# Altium project Motor_Controller_PS.PrjPcb
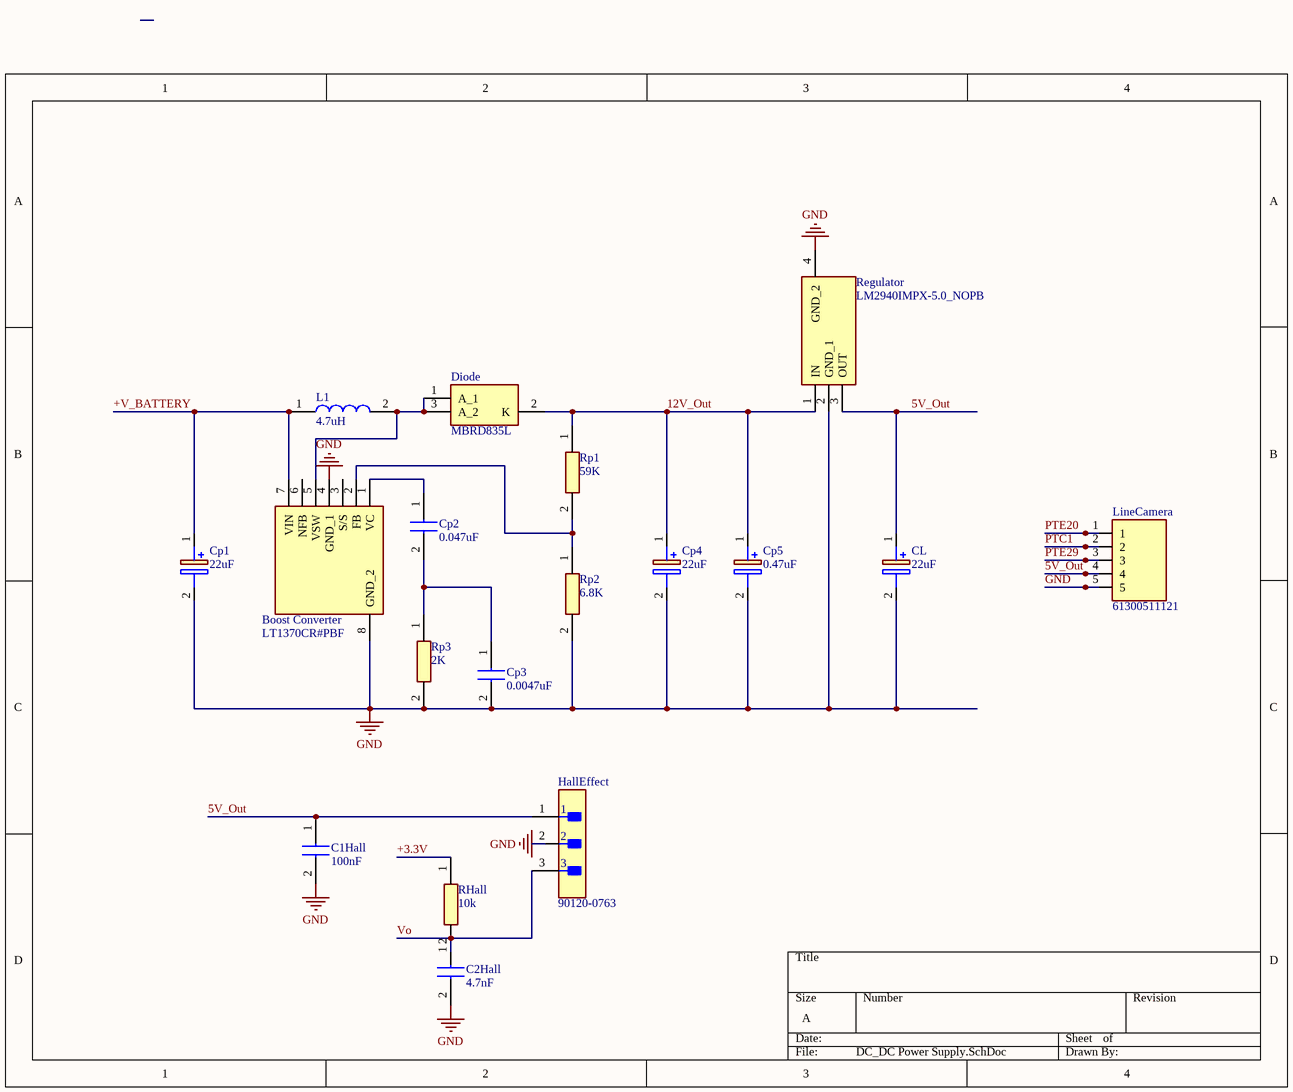
[diagram p0: DC_DC Power Supply.SchDoc]
3 sheets, 40 parts. Net scope: global (net labels, ports and power ports of the same name join across sheets).
Board files: FRDM-Shield_Template.PcbDoc, FDRM_Group6.PcbDoc
Sheets:
  DC_DC Power Supply.SchDoc
  Motor_Controller.SchDoc
  Connectors.SchDoc

## Sheet DC_DC Power Supply.SchDoc
size A; SheetNumber: 1; SheetTotal: 3

### Parts
Boost_Converter  LT1370CR#PBF  [LT1370CRPBF]
C1Hall  100nF  [CAPC5750X450N]
C2Hall  4.7nF  [C1812]
CL  22uF  [CAPAE430X550N]
Cp1  22uF  [CAPAE430X550N]
Cp2  0.047uF  [CAPC0603X33N]
Cp3  0.0047uF  [CAPC0603X33N]
Cp4  22uF  [CAPAE430X550N]
Cp5  0.47uF  [CAPAE430X550N]
Diode  MBRD835L  [MBRD835L]
HallEffect  90120-0763  [FP-90120-0763-MFG]
L1  4.7uH  [ETQ-P4M_KFM]
LineCamera  61300511121  [HDRV5W64P0X254_1X5_1270X254X854P]
Regulator  LM2940IMPX-5.0_NOPB  [SOT230P700X180-4N]
RHall  10k  [RESC1005X40N]
Rp1  59K  [ERJ2RKD1004X]
Rp2  6.8K  [RESC1608X55N]
Rp3  2K  [ERJ2RKD1004X]

### Nets
+3.3V: RHall.1
+V_BATTERY: Boost_Converter.7(VIN) Cp1.1(+) L1.1
GND: Boost_Converter.4(GND_1) Boost_Converter.8(GND_2) C1Hall.2 C2Hall.2 CL.2(-) Cp1.2(-) Cp3.2 Cp4.2(-) Cp5.2(-) HallEffect.2 LineCamera.5 Regulator.2(GND_1) Regulator.4(GND_2) Rp2.2 Rp3.2
5V_Out: C1Hall.1 CL.1(+) HallEffect.1 LineCamera.4 Regulator.3(OUT)
12V_Out: Cp4.1(+) Cp5.1(+) Diode.2(K) Regulator.1(IN) Rp1.1
PTC1: LineCamera.2
PTE20: LineCamera.1
PTE29: LineCamera.3
Vo: C2Hall.1 HallEffect.3 RHall.2
NetBoost_Converter_1: Boost_Converter.1(VC) Cp2.1
NetBoost_Converter_2: Boost_Converter.2(FB) Rp1.2 Rp2.1
NetBoost_Converter_5: Boost_Converter.5(VSW) Diode.1(A_1) Diode.3(A_2) L1.2
NetCp2_2: Cp2.2 Cp3.1 Rp3.1

Not connected (* = marked no-connect by the designer): Boost_Converter 3(S/S) 6(NFB)

### Library data of the parts
Boost_Converter = LT1370CR#PBF: 12V Boost Converter; Manufacturer_Name: Analog Devices; Datasheet Link: https://www.analog.com/media/en/technical-documentation/data-sheets/1370fs.pdf; Height: 4.877mm; Manufacturer_Part_Number: LT1370CR#PBF; Mouser Part Number: 584-LT1370CR#PBF; Mouser Price/Stock: https://www.mouser.co.uk/ProductDetail/Analog-Devices/LT1370CRPBF?qs=ytflclh7QUVSQHKAEhLuUA%3D%3D; Arrow Part Number: LT1370CR#PBF; Arrow Price/Stock: https://www.arrow.com/en/products/lt1370crpbf/analog-devices?utm_currency=USD&region=nac
C1Hall = 2220Y2K00104KXRWS3: Capacitor; Manufacturer_Name: Knowles; Datasheet Link: https://www.knowlescapacitors.com/getattachment/e7984308-bd6c-4e1d-824e-8ae6037a2b25/StackiCap; Height: 4.5mm; Manufacturer_Part_Number: 2220Y2K00104KXRWS3; Mouser Part Number: 843-2220Y2K104KXRWS2; Mouser Price/Stock: https://www.mouser.co.uk/ProductDetail/Knowles-Syfer/2220Y2K00104KXRWS3?qs=7MVldsJ5UaxGI75VDyrs7w%3D%3D
C2Hall = C1812C472KGRACAUTO: Capacitor; Manufacturer_Name: KEMET; Datasheet Link: https://content.kemet.com/datasheets/KEM_C1076_X7R_HV_AUTO_SMD.pdf; Height: 1.55mm; Manufacturer_Part_Number: C1812C472KGRACAUTO; Mouser Part Number: 80-C1812C472KGRAUTO; Mouser Price/Stock: https://www.mouser.co.uk/ProductDetail/KEMET/C1812C472KGRACAUTO?qs=f9yNj16SXrLK%252BHmDDKifeA%3D%3D; Arrow Part Number: C1812C472KGRACAUTO; Arrow Price/Stock: https://www.arrow.com/en/products/c1812c472kgracauto/kemet-corporation
CL Cp1 Cp4 = UWP1HR22MCL1GB: Capacitor Polarised; Manufacturer_Name: Nichicon; Datasheet Link: https://www.nichicon.co.jp/english/series_items/catalog_pdf/e-uwp.pdf; Height: 5.5mm; Manufacturer_Part_Number: UWP1HR22MCL1GB; Mouser Part Number: 647-UWP1HR22MCL; Mouser Price/Stock: https://www.mouser.co.uk/ProductDetail/Nichicon/UWP1HR22MCL1GB?qs=3GbUB62Nf7dRFOPfOwO6sg%3D%3D
  Cp1: Supplier 1: Digikey; Supplier Part Number 1: 493-9831-1-ND
Cp2 = GRM033R61C473KE84D: Capacitor; Manufacturer_Name: Murata Electronics; Datasheet Link: https://search.murata.co.jp/Ceramy/image/img/A01X/G101/ENG/GRM033R61C473KE84-01A.pdf; Height: 0.33mm; Manufacturer_Part_Number: GRM033R61C473KE84D; Mouser Part Number: 81-GRM033R61C473KE4D; Mouser Price/Stock: https://www.mouser.co.uk/ProductDetail/Murata-Electronics/GRM033R61C473KE84D?qs=vCoBJ5OiJk4E%252B%2Fgs75qrtQ%3D%3D; Arrow Part Number: GRM033R61C473KE84D; Arrow Price/Stock: https://www.arrow.com/en/products/grm033r61c473ke84d/murata-manufacturing
Cp3 = GRM033R71A472KA01D: Capacitor; Manufacturer_Name: Murata Electronics; Datasheet Link: https://search.murata.co.jp/Ceramy/image/img/A01X/G101/ENG/GRM033R71A472KA01-01A.pdf; Height: 0.33mm; Manufacturer_Part_Number: GRM033R71A472KA01D; Mouser Part Number: 81-GRM033R71A472KA1D; Mouser Price/Stock: https://www.mouser.co.uk/ProductDetail/Murata-Electronics/GRM033R71A472KA01D?qs=7RtWncwVCuzI4WvsbOl%2FQA%3D%3D; Arrow Part Number: GRM033R71A472KA01D; Arrow Price/Stock: https://www.arrow.com/en/products/grm033r71a472ka01d/murata-manufacturing
Cp5 = 865230640004: Capacitor Polarised; Manufacturer_Name: Wurth Elektronik; Datasheet Link: https://componentsearchengine.com/Datasheets/1/865230640004.pdf; Height: 5.5mm; Manufacturer_Part_Number: 865230640004; Mouser Part Number: 710-865230640004; Mouser Price/Stock: https://www.mouser.co.uk/ProductDetail/Wurth-Elektronik/865230640004?qs=0KOYDY2FL2%2FYTqRiFtrQpw%3D%3D
Diode = MBRD835L: Diode; Manufacturer_Name: onsemi; Datasheet Link: https://www.onsemi.com/pdf/datasheet/mbrd835l-d.pdf; Height: 2.38mm; Manufacturer_Part_Number: MBRD835L; Mouser Part Number: 863-MBRD835L; Mouser Price/Stock: https://www.mouser.co.uk/ProductDetail/onsemi/MBRD835L?qs=3JMERSakebplE9MTkRawVw%3D%3D
HallEffect = CMP-04776-000084-1: CONN HEADER VERT 3POS 2.54MM; Manufacturer: Molex; Voltage Rating: 350V; Number Of Contacts: 3; Conn Orientation: Vertical; Current Rating: 3A; Conn Gender: Male; Package: 90120-0763; ComponentLink2Description: Datasheet; Height: 5.8mm; Manufacturer Part Number: 90120-0763; Temperature Range High: +125°C; RoHS: TRUE; ComponentLink2URL: https://www.molex.com/webdocs/datasheets/pdf/en-us/0901200763_PCB_HEADERS.pdf; Device Class L2: Headers and Wire Housings; Temperature: -55°C to +125°C; Device Class L1: Connectors; Pitch: 2.54mm; Footprint Url: https://www.molex.com/pdm_docs/sd/901200763_sd.pdf; Device Class L3: unset; Temperature Range Low: -55°C; Number Of Rows: 1; Category: Conn; Lead Free: Yes; Mouser Description: Board-To-Board Connector, C-Grid III 90120 Series, Through Hole, Header, 3, 2.54 mm; Octopart: https://octopart.com/90120-0763-molex-655433; Contact Material: Gold,Nickel; Automotive: No; Digikey Description: CONN HEADER VERT 3POS 2.54MM
L1 = ETQ-P4M4R7KFM: Inductor; Manufacturer_Name: Panasonic; Datasheet Link: http://industrial.panasonic.com/cdbs/www-data/pdf/AGL0000/AGL0000C73.pdf; Height: 4.8mm; Manufacturer_Part_Number: ETQ-P4M4R7KFM; Mouser Part Number: 667-ETQ-P4M4R7KFM; Mouser Price/Stock: https://www.mouser.co.uk/ProductDetail/Panasonic/ETQ-P4M4R7KFM?qs=PqoDHHvF649m773nMECVZA%3D%3D
LineCamera = 61300511121: Connector; Manufacturer_Name: Wurth Elektronik; Datasheet Link: http://katalog.we-online.de/em/datasheet/6130xx11121.pdf; Height: 8.54mm; Manufacturer_Part_Number: 61300511121; Mouser Part Number: 710-61300511121; Mouser Price/Stock: https://www.mouser.co.uk/ProductDetail/Wurth-Elektronik/61300511121?qs=PhR8RmCirEZCsCRHq%252BvfRQ%3D%3D
Regulator = LM2940IMPX-5.0_NOPB: Integrated Circuit; Manufacturer_Name: Texas Instruments; Manufacturer_Part_Number: LM2940IMPX-5.0/NOPB; Datasheet Link: http://www.ti.com/lit/gpn/lm2940-n; Height: 1.8mm; Mouser Part Number: 926-LM2940IMPX50NOPB; Mouser Price/Stock: https://www.mouser.co.uk/ProductDetail/Texas-Instruments/LM2940IMPX-5.0-NOPB?qs=X1J7HmVL2ZELzMHXu8bpyQ%3D%3D; Arrow Part Number: LM2940IMPX-5.0/NOPB; Arrow Price/Stock: https://www.arrow.com/en/products/lm2940impx-5.0nopb/texas-instruments?region=nac
RHall = RC0402JR-0710KL: Resistor; Manufacturer_Name: KEMET; Datasheet Link: http://www.yageo.com/documents/recent/PYu-RC0402_51_RoHS_L_6_r.pdf; Height: 0.4mm; Manufacturer_Part_Number: RC0402JR-0710KL; Mouser Part Number: 603-RC0402JR-0710KL; Mouser Price/Stock: https://www.mouser.co.uk/ProductDetail/YAGEO/RC0402JR-0710KL?qs=V1yeUXFNrkk4BhFptVo0Rw%3D%3D
Rp1 = ERJ-2RKF5902X: Resistor; Manufacturer_Name: Panasonic; Datasheet Link: https://industrial.panasonic.com/cdbs/www-data/pdf/RDA0000/AOA0000C86.pdf; Height: 0.4mm; Manufacturer_Part_Number: ERJ-2RKF5902X; Mouser Part Number: 667-ERJ-2RKF5902X; Mouser Price/Stock: https://www.mouser.co.uk/ProductDetail/Panasonic/ERJ-2RKF5902X?qs=YMBIwoNQYdVdwi4zXGse%252Bw%3D%3D; Arrow Part Number: ERJ-2RKF5902X; Arrow Price/Stock: https://www.arrow.com/en/products/erj-2rkf5902x/panasonic?region=nac
Rp2 = RC0603FR-106K8L: Resistor; Manufacturer_Name: KEMET; Datasheet Link: http://www.yageo.com/documents/recent/PYu-RC0603_51_RoHS_L_v5.pdf; Height: 0.55mm; Manufacturer_Part_Number: RC0603FR-106K8L; Mouser Part Number: 603-RC0603FR-106K8L; Mouser Price/Stock: https://www.mouser.co.uk/ProductDetail/YAGEO/RC0603FR-106K8L?qs=Iqe6t0HYRD4RKBucIg6YEg%3D%3D
Rp3 = ERJ-2RKF2001X: Resistor; Manufacturer_Name: Panasonic; Datasheet Link: https://industrial.panasonic.com/cdbs/www-data/pdf/RDA0000/AOA0000C86.pdf; Height: 0.4mm; Manufacturer_Part_Number: ERJ-2RKF2001X; Mouser Part Number: 667-ERJ-2RKF2001X; Mouser Price/Stock: https://www.mouser.co.uk/ProductDetail/Panasonic/ERJ-2RKF2001X?qs=H7k1u0Mp9JSbtBe1nkwQGA%3D%3D; Arrow Part Number: ERJ-2RKF2001X; Arrow Price/Stock: https://www.arrow.com/en/products/erj-2rkf2001x/panasonic?region=europe

## Sheet Motor_Controller.SchDoc
size A; SheetNumber: 2; SheetTotal: 3
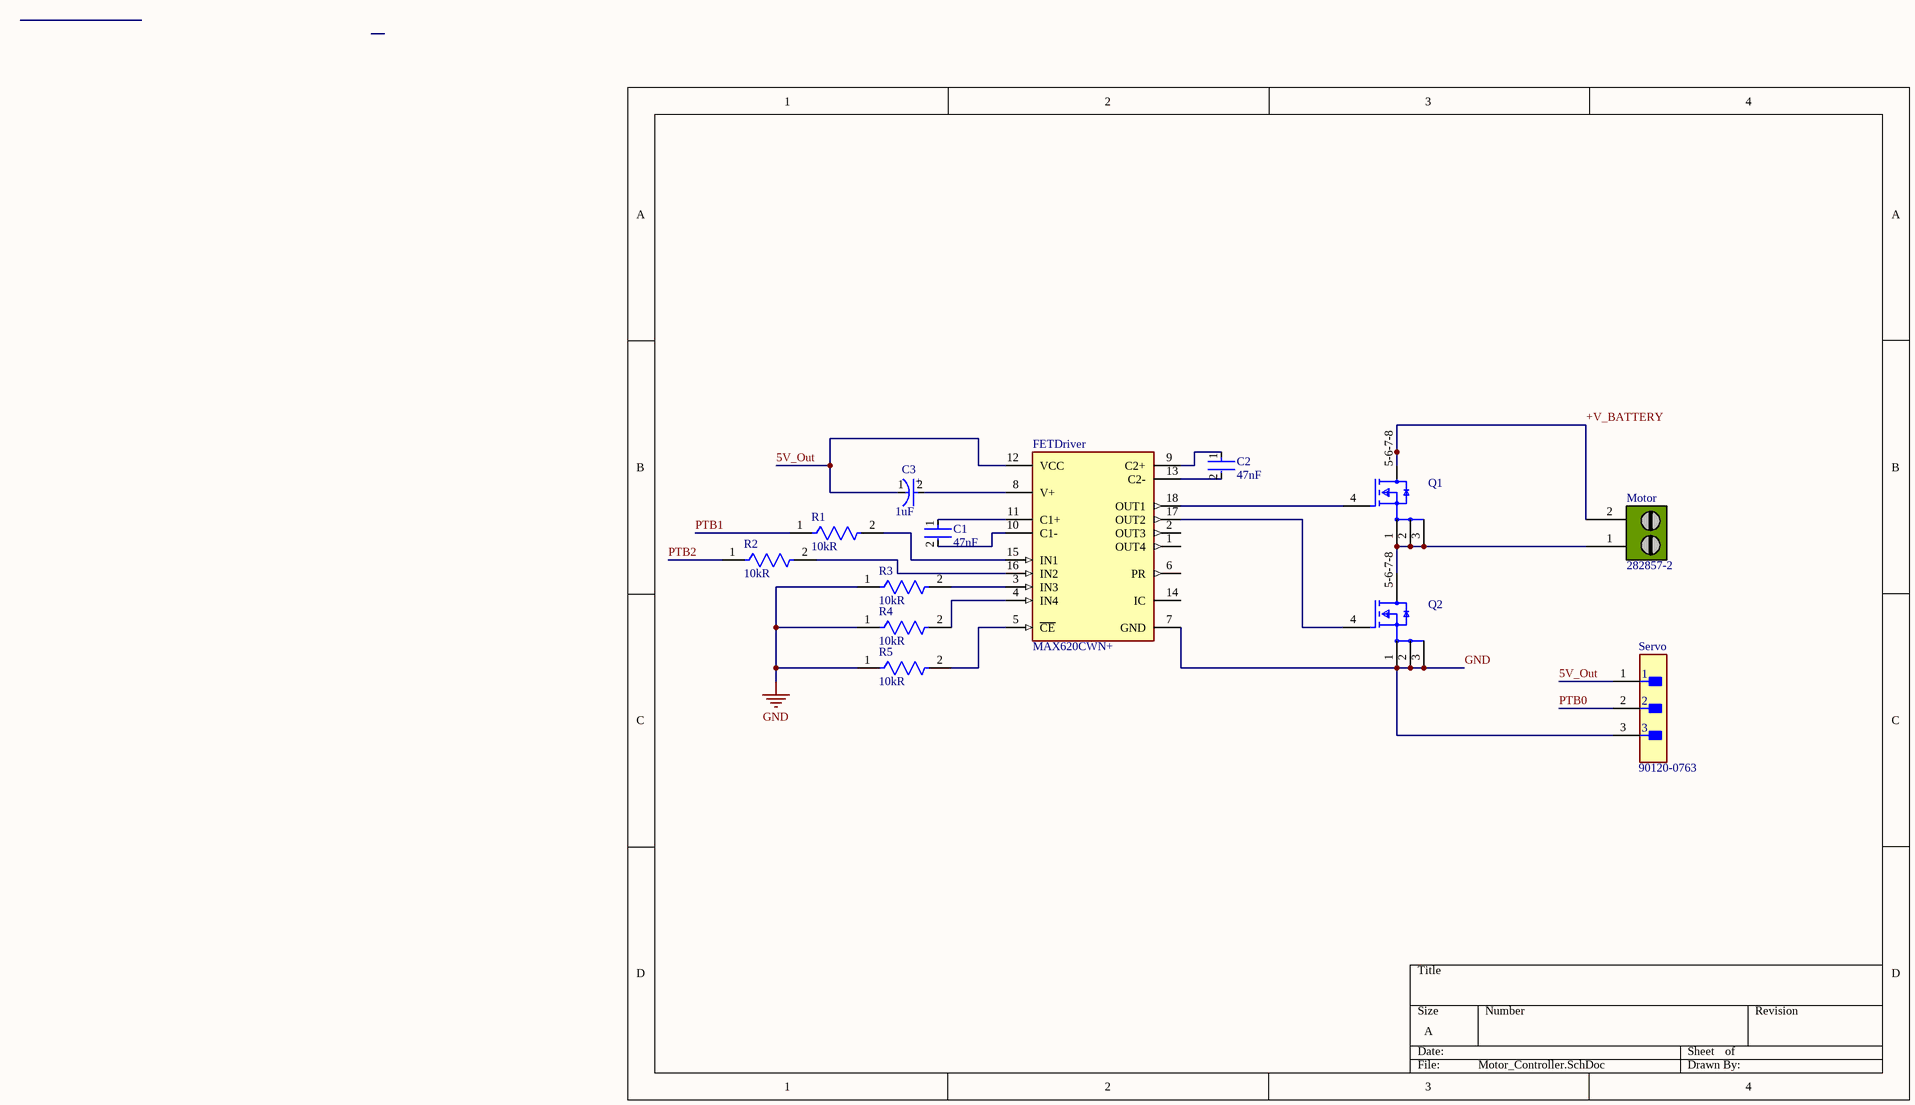
[diagram p1: Motor_Controller.SchDoc]

### Parts
C1  Capacitance: 47nF  [FP-0805-L_2_01_0_2-W_1_25-IPC_B]  (hidden comment: 08055C473JAT2A)
C2  Capacitance: 47nF  [FP-0805-L_2_01_0_2-W_1_25-IPC_B]  (hidden comment: 08055C473JAT2A)
C3  Capacitance: 1uF  [FP-T491A105K025AT-MFG]  (hidden comment: T491A105K025AT)
FETDriver  MAX620CWN+  [FP-W18-1-MFG]
Motor  282857-2  [282857-2]
Q1  CSD17306Q5A  [FP-DQJ0008A-MFG]  (value not drawn)
Q2  CSD17306Q5A  [FP-DQJ0008A-MFG]  (value not drawn)
R1  Resistance: 10kR  [FP-CR0805-IPC_B]  (hidden comment: CR0805-JW-103ELF)
R2  Resistance: 10kR  [FP-CR0805-IPC_B]  (hidden comment: CR0805-JW-103ELF)
R3  Resistance: 10kR  [FP-CR0805-IPC_B]  (hidden comment: CR0805-JW-103ELF)
R4  Resistance: 10kR  [FP-CR0805-IPC_B]  (hidden comment: CR0805-JW-103ELF)
R5  Resistance: 10kR  [FP-CR0805-IPC_B]  (hidden comment: CR0805-JW-103ELF)
Servo  90120-0763  [FP-90120-0763-MFG]

### Nets
+V_BATTERY: Motor.2 Q1.5-6-7-8(D)
GND: FETDriver.7(GND) Q2.1(S) Q2.2(S) Q2.3(S) R3.1 R4.1 R5.1 Servo.3
5V_Out: C3.1(C) FETDriver.12(VCC) Servo.1
PTB0: Servo.2
PTB1: R1.1
PTB2: R2.1
NetC1_1: C1.1 FETDriver.11(C1+)
NetC1_2: C1.2 FETDriver.10(C1-)
NetC2_1: C2.1 FETDriver.9(C2+)
NetC2_2: C2.2 FETDriver.13(C2-)
NetC3_2: C3.2(A) FETDriver.8(V+)
NetFETDriver_3: FETDriver.3(IN3) R3.2
NetFETDriver_4: FETDriver.4(IN4) R4.2
NetFETDriver_5: FETDriver.5(~{CE}) R5.2
NetFETDriver_15: FETDriver.15(IN1) R1.2
NetFETDriver_16: FETDriver.16(IN2) R2.2
NetFETDriver_17: FETDriver.17(OUT2) Q2.4(G)
NetFETDriver_18: FETDriver.18(OUT1) Q1.4(G)
NetMotor_1: Motor.1 Q1.1(S) Q1.2(S) Q1.3(S) Q2.5-6-7-8(D)

Not connected (* = marked no-connect by the designer): FETDriver 1(OUT4) 2(OUT3) 6(PR) 14(IC)

### Notes on the sheet
- (in symbol CMP-03017-000047-1) +

### Library data of the parts
C1 C2 = CMP-2007-04425-2: General Purpose Ceramic Capacitor, 0805, 47nF, 5%, X7R, 0.15, 50V; Dissipation Factor: 2.5%; Tolerance: 10%; Voltage: 50V; Voltage Rating (DC): 50V; Case Code (Imperial): 0805; Termination: SMD/SMT; Lead Free: Lead Free; Construction: Flat; Case Code (Metric): 2012; Series: -; Height: 0.94mm; Length: 2.01mm; Dielectric: X7R; Min Operating Temperature: -55°C; Voltage Rating: 50V; Max Operating Temperature: 125°C; Width: 0.049inch; Dielectric Material: Ceramic; Thickness: 0.037inch; Mount: Surface Mount; Radiation Hardening: No; REACH SVHC: No SVHC; Number of Pins: 2; Case/Package: 0805; Packaging: Tape and Reel; RoHS Compliant: Yes; Contact Plating: Tin; Depth: 1.25mm; Package Quantity: 1
C3 = CMP-03017-000047-1: CAP TANT 1UF 10% 25V 1206; Polarity: Polar; Leakage Current: 500nA; ESR (Equivalent Series Resistance): 8R; Tolerance: 20%; Dielectric Material: Tantalum; Life (Hours): 2000Hour; Dissipation Factor: 4%; Case/Package: 1206; RoHS Compliant: Yes; Voltage Rating: 25V; Voltage Rating (DC): 25V; Max Operating Temperature: 125°C; REACH SVHC: No SVHC; Lead Pitch: 1.2mm; Height - Seated (Max): 0.071inch; Packaging: Tape and Reel; Lead Free: Lead Free; Radiation Hardening: No; Width: 1.6mm; Depth: 1.6mm; Number of Pins: 2; Termination: SMD/SMT; Case Code (Metric): 3216; Features: General Purpose; Voltage: 25V; Min Operating Temperature: -55°C; Package Quantity: 1; Mount: Surface Mount; Length: 3.2mm; Height: 1.6mm; Case Code (Imperial): 1206
FETDriver = CMP-05716-000008-1: IC GATE DRVR HIGH-SIDE 18SOIC; Nominal Supply Current: 500uA; Max Power Dissipation: 762mW; Fall Time: 2500ns; Max Output Current: 25mA; Rise Time: 1700ns; Min Supply Voltage: 4.5V; Max Supply Voltage: 16.5V; Number of Outputs: 4; Max Operating Temperature: 70°C; Packaging: Rail/Tube; Mount: Surface Mount; Lead Free: Lead Free; Min Operating Temperature: 0°C; Package Quantity: 40; Radiation Hardening: No; Number of Pins: 18; Max Supply Current: 500uA; Case/Package: SOIC; Supply Current: 500uA; RoHS Compliant: Yes; Number of Drivers: 4; Series: -
Motor = 282857-2: TERM BLOCK 2POS SIDE ENT 5.08MM; Manufacturer: TE Connectivity; Number of Levels: 1; Positions Per Level: 2; Pitch: 0.200" (5.08mm); Mating Orientation: Horizontal with Board; Current: 24A; Voltage: 300V; Wire Gauge: 12-30 AWG; Wire Termination: Screw - Rising Cage Clamp; Clamp Material - Plating: Brass - Nickel Plated; Torque - Screw: 0.79 Nm (7.0 Lb-In); Screw Thread: M3; Supplier 1: Digi-Key; Supplier Part Number 1: A98359-ND; Manufacturer Part Number: 282857-2; RoHS: RoHS Compliant; Category: Connectors, Interconnects; Stock 1: 1811; Pricing 1: 1=1.19, 10=1.046, 25=0.984, 50=0.9432, 100=0.9021, 250=0.82012, 500=0.7381, 1000=0.65608, 2500=0.59457 (USD); Mounting Type: Through Hole; Features: Interlocking (Side); Color: Green; Packaging: Bulk; Operating Temperature: -; Housing Material: Polyamide (PA66), Nylon 6/6; Contact Material - Plating: Brass - Tin Plated; Screw Material - Plating: Brass - Nickel Plated; ComponentLink1URL: http://documents.tycoelectronics.com/commerce/DocumentDelivery/DDEController?Action=srchrtrv&DocNm=282857&DocType=CD&DocLang=EN; ComponentLink1Description: http://documents.tycoelectronics.com/commerce/DocumentDelivery/DDEController?Action=srchrtrv&DocNm=282857&DocType=CD&DocLang=EN; Value: 282857-2
Q1 Q2 = CMP-04962-000068-1: MOSFET N-CH 30V 24A/100A 8VSON; Element Configuration: Single; Number of Elements: 1; Turn-Off Delay Time: 18.4ns; Nominal Vgs: 1.1V; Drain to Source Resistance: 3.3mR; Rds On Max: 3.7mR; Rise Time: 13.1ns; Fall Time: 6.4ns; Turn-On Delay Time: 7.8ns; Continuous Drain Current (ID): 100A; Power Dissipation: 3.2W; Input Capacitance: 2.17nF; Gate to Source Voltage (Vgs): 10V; Polarity: N-CHANNEL; Drain to Source Breakdown Voltage: 30V; Mount: Surface Mount; Radiation Hardening: No; RoHS Compliant: Yes; Threshold Voltage: 1.1V; Contact Plating: Tin; Package Quantity: 1; Packaging: Tape and Reel; Lead Free: Contains Lead; Width: 5mm; Case/Package: SON; Max Operating Temperature: 150°C; Length: 5.8mm; Series: NexFET™; Drain to Source Voltage (Vdss): 30V; Number of Pins: 8; Min Operating Temperature: -55°C; Max Power Dissipation: 3.2W; REACH SVHC: No SVHC; Height: 1.1mm
R1-R5 = CMP-07231-003873-1: Thick Film Chip Resistors 0805 10kΩ 0.125W 5% 200ppm/°C; Power Rating: 125mW; Voltage Rating (DC): 100V; Voltage Rating: 150V; Width: 1.25mm; Composition: Thick Film; Packaging: Tape and Reel; Number of Terminations: 2; Min Operating Temperature: -55°C; Height: 0.5mm; Temperature Coefficient: 200ppm/°C; Features: Moisture Resistant; Termination: SMD/SMT; Case Code (Imperial): 0805; Package Quantity: 1; Radiation Hardening: No; Military Standard: Not; Thickness: 508um; Depth: 1.25mm; Tolerance: 5%; Contact Plating: Tin; Number of Pins: 2; Length: 2mm; Max Power Dissipation: 125mW; Mount: Surface Mount; Case Code (Metric): 2012; Case/Package: 0805; REACH SVHC: No SVHC; Max Operating Temperature: 155°C
Servo = CMP-04776-000084-1: as HallEffect on sheet DC_DC Power Supply; Package: 90120-0763; ComponentLink2Description: Datasheet; Height: 5.8mm; Manufacturer Part Number: 90120-0763; Temperature Range High: +125°C; RoHS: TRUE; ComponentLink2URL: https://www.molex.com/webdocs/datasheets/pdf/en-us/0901200763_PCB_HEADERS.pdf; Device Class L2: Headers and Wire Housings; Temperature: -55°C to +125°C; Device Class L1: Connectors; Pitch: 2.54mm; Footprint Url: https://www.molex.com/pdm_docs/sd/901200763_sd.pdf; Device Class L3: unset; Temperature Range Low: -55°C; Number Of Rows: 1; Category: Conn; Lead Free: Yes; Mouser Description: Board-To-Board Connector, C-Grid III 90120 Series, Through Hole, Header, 3, 2.54 mm; Octopart: https://octopart.com/90120-0763-molex-655433; Contact Material: Gold,Nickel; Automotive: No; Digikey Description: CONN HEADER VERT 3POS 2.54MM

## Sheet Connectors.SchDoc: TRW-TFC
size D; SheetNumber: 3; SheetTotal: 3
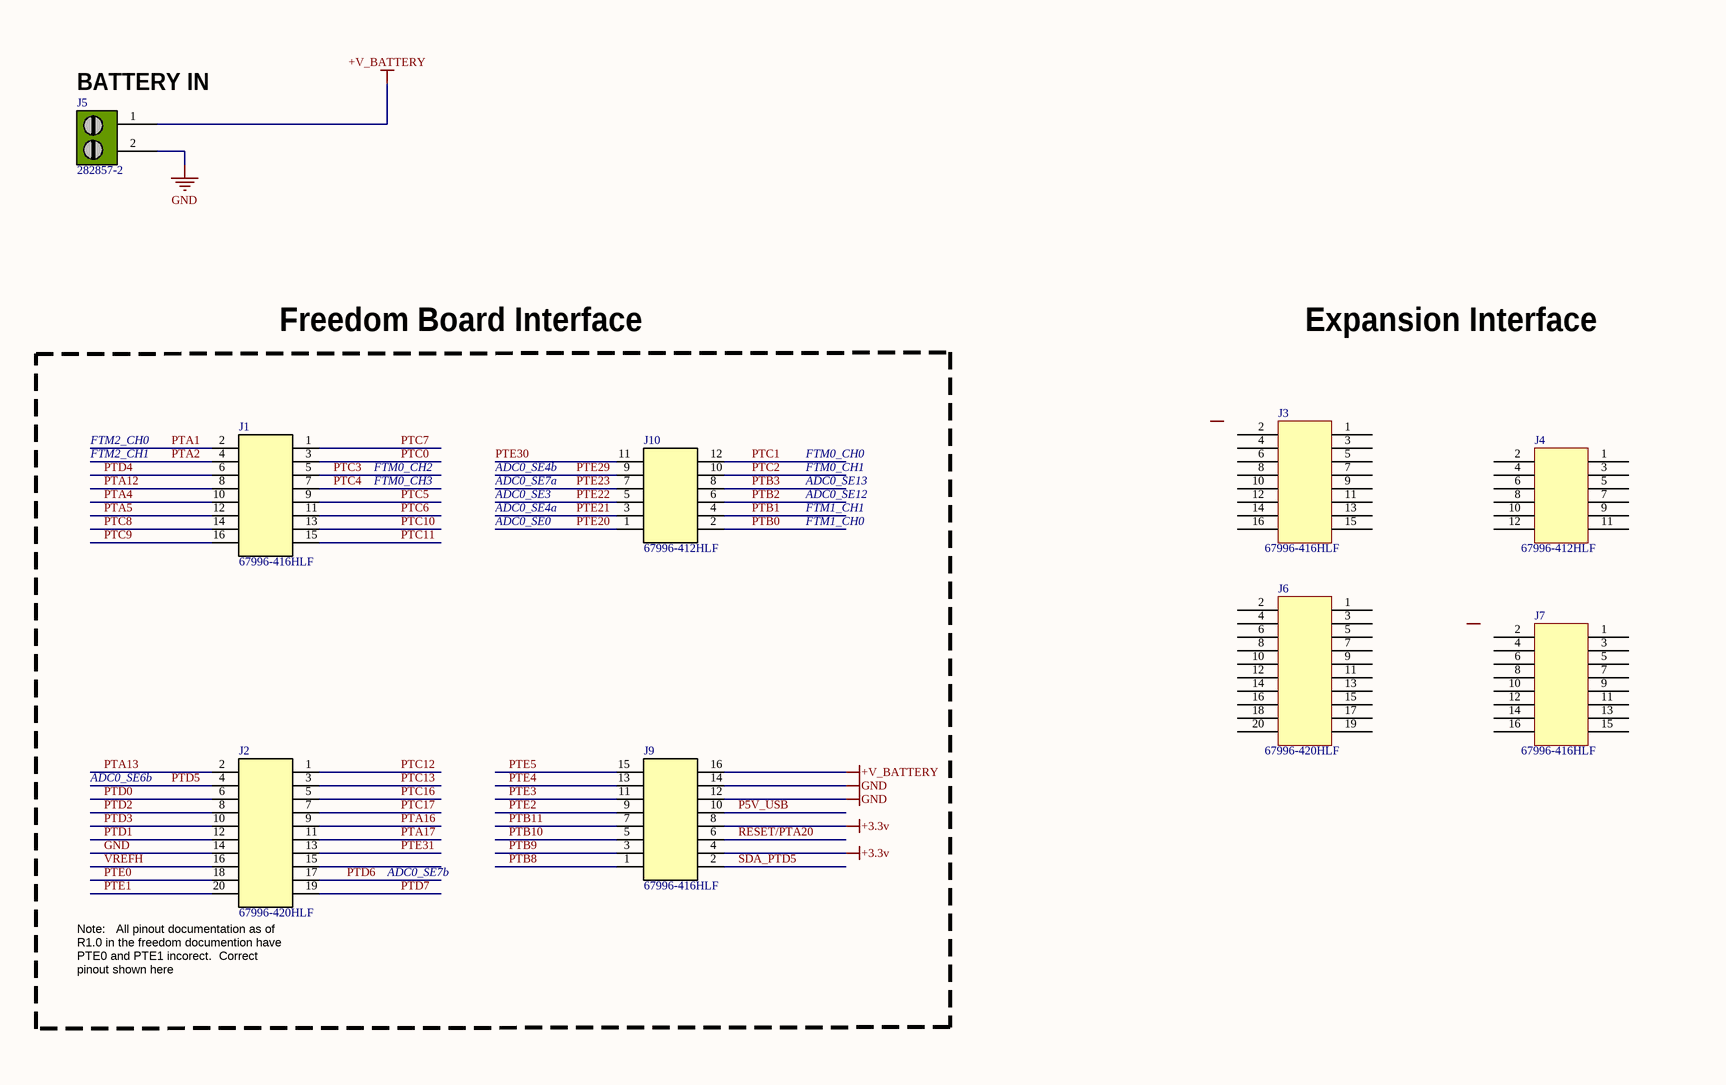
[diagram p2: Connectors.SchDoc, top left]
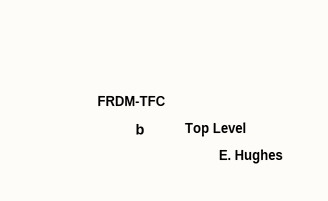
[diagram p3: Connectors.SchDoc, bottom right]

### Parts
J1  67996-416HLF  [67996-416HLF]
J2  67996-420HLF  [67996-420HLF]
J3  67996-416HLF  [67996-416HLF]
J4  67996-412HLF  [67996-412HLF]
J5  282857-2  [282857-2]
J6  67996-420HLF  [67996-420HLF]
J7  67996-416HLF  [67996-416HLF]
J9  67996-416HLF  [67996-416HLF]
J10  67996-412HLF  [67996-412HLF]

### Blocks framed on the sheet
Freedom Board Interface: J1 J2 J9 J10

### Nets
+3.3V: J9.4 J9.8
+V_BATTERY: J5.1 J9.16
GND: J2.14 J5.2 J9.12 J9.14
P5V_USB: J9.10
PTA1: J1.2
PTA2: J1.4
PTA4: J1.10
PTA5: J1.12
PTA12: J1.8
PTA13: J2.2
PTA16: J2.9
PTA17: J2.11
PTB0: J10.2
PTB1: J10.4
PTB2: J10.6
PTB3: J10.8
PTB8: J9.1
PTB9: J9.3
PTB10: J9.5
PTB11: J9.7
PTC0: J1.3
PTC1: J10.12
PTC2: J10.10
PTC3: J1.5
PTC4: J1.7
PTC5: J1.9
PTC6: J1.11
PTC7: J1.1
PTC8: J1.14
PTC9: J1.16
PTC10: J1.13
PTC11: J1.15
PTC12: J2.1
PTC13: J2.3
PTC16: J2.5
PTC17: J2.7
PTD0: J2.6
PTD1: J2.12
PTD2: J2.8
PTD3: J2.10
PTD4: J1.6
PTD5: J2.4
PTD6: J2.17
PTD7: J2.19
PTE0: J2.18
PTE1: J2.20
PTE2: J9.9
PTE3: J9.11
PTE4: J9.13
PTE5: J9.15
PTE20: J10.1
PTE21: J10.3
PTE22: J10.5
PTE23: J10.7
PTE29: J10.9
PTE30: J10.11
PTE31: J2.13
RESET/PTA20: J9.6
SDA_PTD5: J9.2
VREFH: J2.16

Not connected (* = marked no-connect by the designer): J2 15; J3 1 2 3 4 5 6 7 8 9 10 11 12 13 14 15 16; J4 1 2 3 4 5 6 7 8 9 10 11 12; J6 1 2 3 4 5 6 7 8 9 10 11 12 13 14 15 16 17 18 19 20; J7 1 2 3 4 5 6 7 8 9 10 11 12 13 14 15 16

### Notes on the sheet
- (near J5) BATTERY IN
- Expansion Interface
- FTM2_CH0
- FTM2_CH1
- FTM0_CH2
- FTM0_CH3
- ADC0_SE4b
- ADC0_SE3
- ADC0_SE7a
- FTM0_CH0
- FTM0_CH1
- ADC0_SE12
- ADC0_SE13
- ADC0_SE0
- ADC0_SE4a
- FTM1_CH0
- FTM1_CH1
- ADC0_SE6b
- ADC0_SE7b
- (near J2) Note:   All pinout documentation as of R1.0 in the freedom documention have PTE0 and PTE1 incorect.  Correct pinout shown here
- FRDM-TFC
- b
- Top Level
- E. Hughes
- -1
- 2
- Wavenumber
- Technologies
- pl
- Rev:
- Sheet
- of

### Library data of the parts
J1 J9 = 67996-416HLF: CONN HEADER 16POS .100 STR TIN; Manufacturer: FCI; Connector Type: Header, Unshrouded; Number of Positions: 16; Number of Positions Loaded: All; Pitch: 0.100" (2.54mm); Manufacturer Part Number: 67996-416HLF; RoHS: RoHS Compliant; Category: Connectors, Interconnects; Contact Type: Male Pin; Number of Rows: 2; Row Spacing: 0.100" (2.54mm); Contact Mating Length: 0.230" (5.84mm); Mounting Type: Through Hole; Termination: Solder; Fastening Type: -; Features: -; Contact Finish: Tin; Contact Finish Thickness: 100µin (2.54µm); Color: Black; Packaging: Bulk; ComponentLink1URL: http://portal.fciconnect.com/Comergent//fci/drawing/67996.pdf; ComponentLink1Description: http://portal.fciconnect.com/Comergent//fci/drawing/67996.pdf; Value: 67996-416HLF; Supplier 1: Digi-Key; Supplier Part Number 1: 609-3220-ND; Stock 1: 1589; Pricing 1: 1=0.56, 10=0.521, 25=0.4684, 50=0.4164, 100=0.3991, 250=0.36436, 500=0.347, 1000=0.28628, 2500=0.26025 (USD)
J2 = 67996-420HLF: CONN HEADER 20POS .100 STR TIN; Manufacturer: FCI; Connector Type: Header, Unshrouded; Number of Positions: 20; Number of Positions Loaded: All; Pitch: 0.100" (2.54mm); Supplier 1: Digi-Key; Supplier Part Number 1: 609-3221-ND; Manufacturer Part Number: 67996-420HLF; RoHS: RoHS Compliant; Category: Connectors, Interconnects; Stock 1: 596; Pricing 1: 1=0.66, 10=0.619, 25=0.5572, 50=0.4952, 100=0.4745, 250=0.43324, 500=0.4126, 1000=0.3404, 2500=0.30945 (USD); Contact Type: Male Pin; Number of Rows: 2; Row Spacing: 0.100" (2.54mm); Contact Mating Length: 0.230" (5.84mm); Mounting Type: Through Hole; Termination: Solder; Fastening Type: -; Features: -; Contact Finish: Tin; Contact Finish Thickness: 100µin (2.54µm); Color: Black; Packaging: Bulk; ComponentLink1URL: http://portal.fciconnect.com/Comergent//fci/drawing/67996.pdf; ComponentLink1Description: http://portal.fciconnect.com/Comergent//fci/drawing/67996.pdf
J3 J7 = 67996-416HLF: CONN HEADER 16POS .100 STR TIN; Supplier 1: Octopart; Supplier Part Number 1: Mouser - 649-67996-416HLF
J4 = 67996-412HLF: CONN HEADER 12POS .100 STR TIN; Supplier 1: Octopart; Supplier Part Number 1: Mouser - 649-67996-412HLF
J5 = 282857-2: as Motor on sheet Motor_Controller; Supplier 1: Digi-Key; Supplier Part Number 1: A98359-ND; Manufacturer Part Number: 282857-2; RoHS: RoHS Compliant; Category: Connectors, Interconnects; Stock 1: 1811; Pricing 1: 1=1.19, 10=1.046, 25=0.984, 50=0.9432, 100=0.9021, 250=0.82012, 500=0.7381, 1000=0.65608, 2500=0.59457 (USD); Mounting Type: Through Hole; Features: Interlocking (Side); Color: Green; Packaging: Bulk; Operating Temperature: -; Housing Material: Polyamide (PA66), Nylon 6/6; Contact Material - Plating: Brass - Tin Plated; Screw Material - Plating: Brass - Nickel Plated; ComponentLink1URL: http://documents.tycoelectronics.com/commerce/DocumentDelivery/DDEController?Action=srchrtrv&DocNm=282857&DocType=CD&DocLang=EN; ComponentLink1Description: http://documents.tycoelectronics.com/commerce/DocumentDelivery/DDEController?Action=srchrtrv&DocNm=282857&DocType=CD&DocLang=EN; Value: 282857-2
J6 = 67996-420HLF: CONN HEADER 20POS .100 STR TIN; Supplier 1: Octopart; Supplier Part Number 1: Mouser - 649-67996-420HLF
J10 = 67996-412HLF: CONN HEADER 12POS .100 STR TIN; Manufacturer: FCI; Connector Type: Header, Unshrouded; Number of Positions: 12; Number of Positions Loaded: All; Pitch: 0.100" (2.54mm); Supplier 1: Digi-Key; Supplier Part Number 1: 609-3219-ND; Manufacturer Part Number: 67996-412HLF; RoHS: RoHS Compliant; Category: Connectors, Interconnects; Stock 1: 1044; Pricing 1: 1=0.4, 10=0.379, 25=0.3248, 50=0.276, 100=0.2651, 250=0.23804, 500=0.22722, 1000=0.18935, 2500=0.17312 (USD); Contact Type: Male Pin; Number of Rows: 2; Row Spacing: 0.100" (2.54mm); Contact Mating Length: 0.230" (5.84mm); Mounting Type: Through Hole; Termination: Solder; Fastening Type: -; Features: -; Contact Finish: Tin; Contact Finish Thickness: 100µin (2.54µm); Color: Black; Packaging: Bulk; ComponentLink1URL: http://portal.fciconnect.com/Comergent//fci/drawing/67996.pdf; ComponentLink1Description: http://portal.fciconnect.com/Comergent//fci/drawing/67996.pdf; Value: 67996-412HLF

## Nets that join several sheets
+3.3V: DC_DC Power Supply (RHall.1), Connectors (J9.4 J9.8)
+V_BATTERY: DC_DC Power Supply (Boost_Converter.7 Cp1.1 L1.1), Motor_Controller (Motor.2 Q1.5-6-7-8), Connectors (J5.1 J9.16)
GND: DC_DC Power Supply (15 pins), Motor_Controller (8 pins), Connectors (J2.14 J5.2 J9.12 J9.14)
5V_Out: DC_DC Power Supply (5 pins), Motor_Controller (C3.1 FETDriver.12 Servo.1)
PTB0: Motor_Controller (Servo.2), Connectors (J10.2)
PTB1: Motor_Controller (R1.1), Connectors (J10.4)
PTB2: Motor_Controller (R2.1), Connectors (J10.6)
PTC1: DC_DC Power Supply (LineCamera.2), Connectors (J10.12)
PTE20: DC_DC Power Supply (LineCamera.1), Connectors (J10.1)
PTE29: DC_DC Power Supply (LineCamera.3), Connectors (J10.9)